# Altium schematic sheet MCU-Board.SchDoc: MCU Board
size A3; SheetNumber: 1; SheetTotal: 1
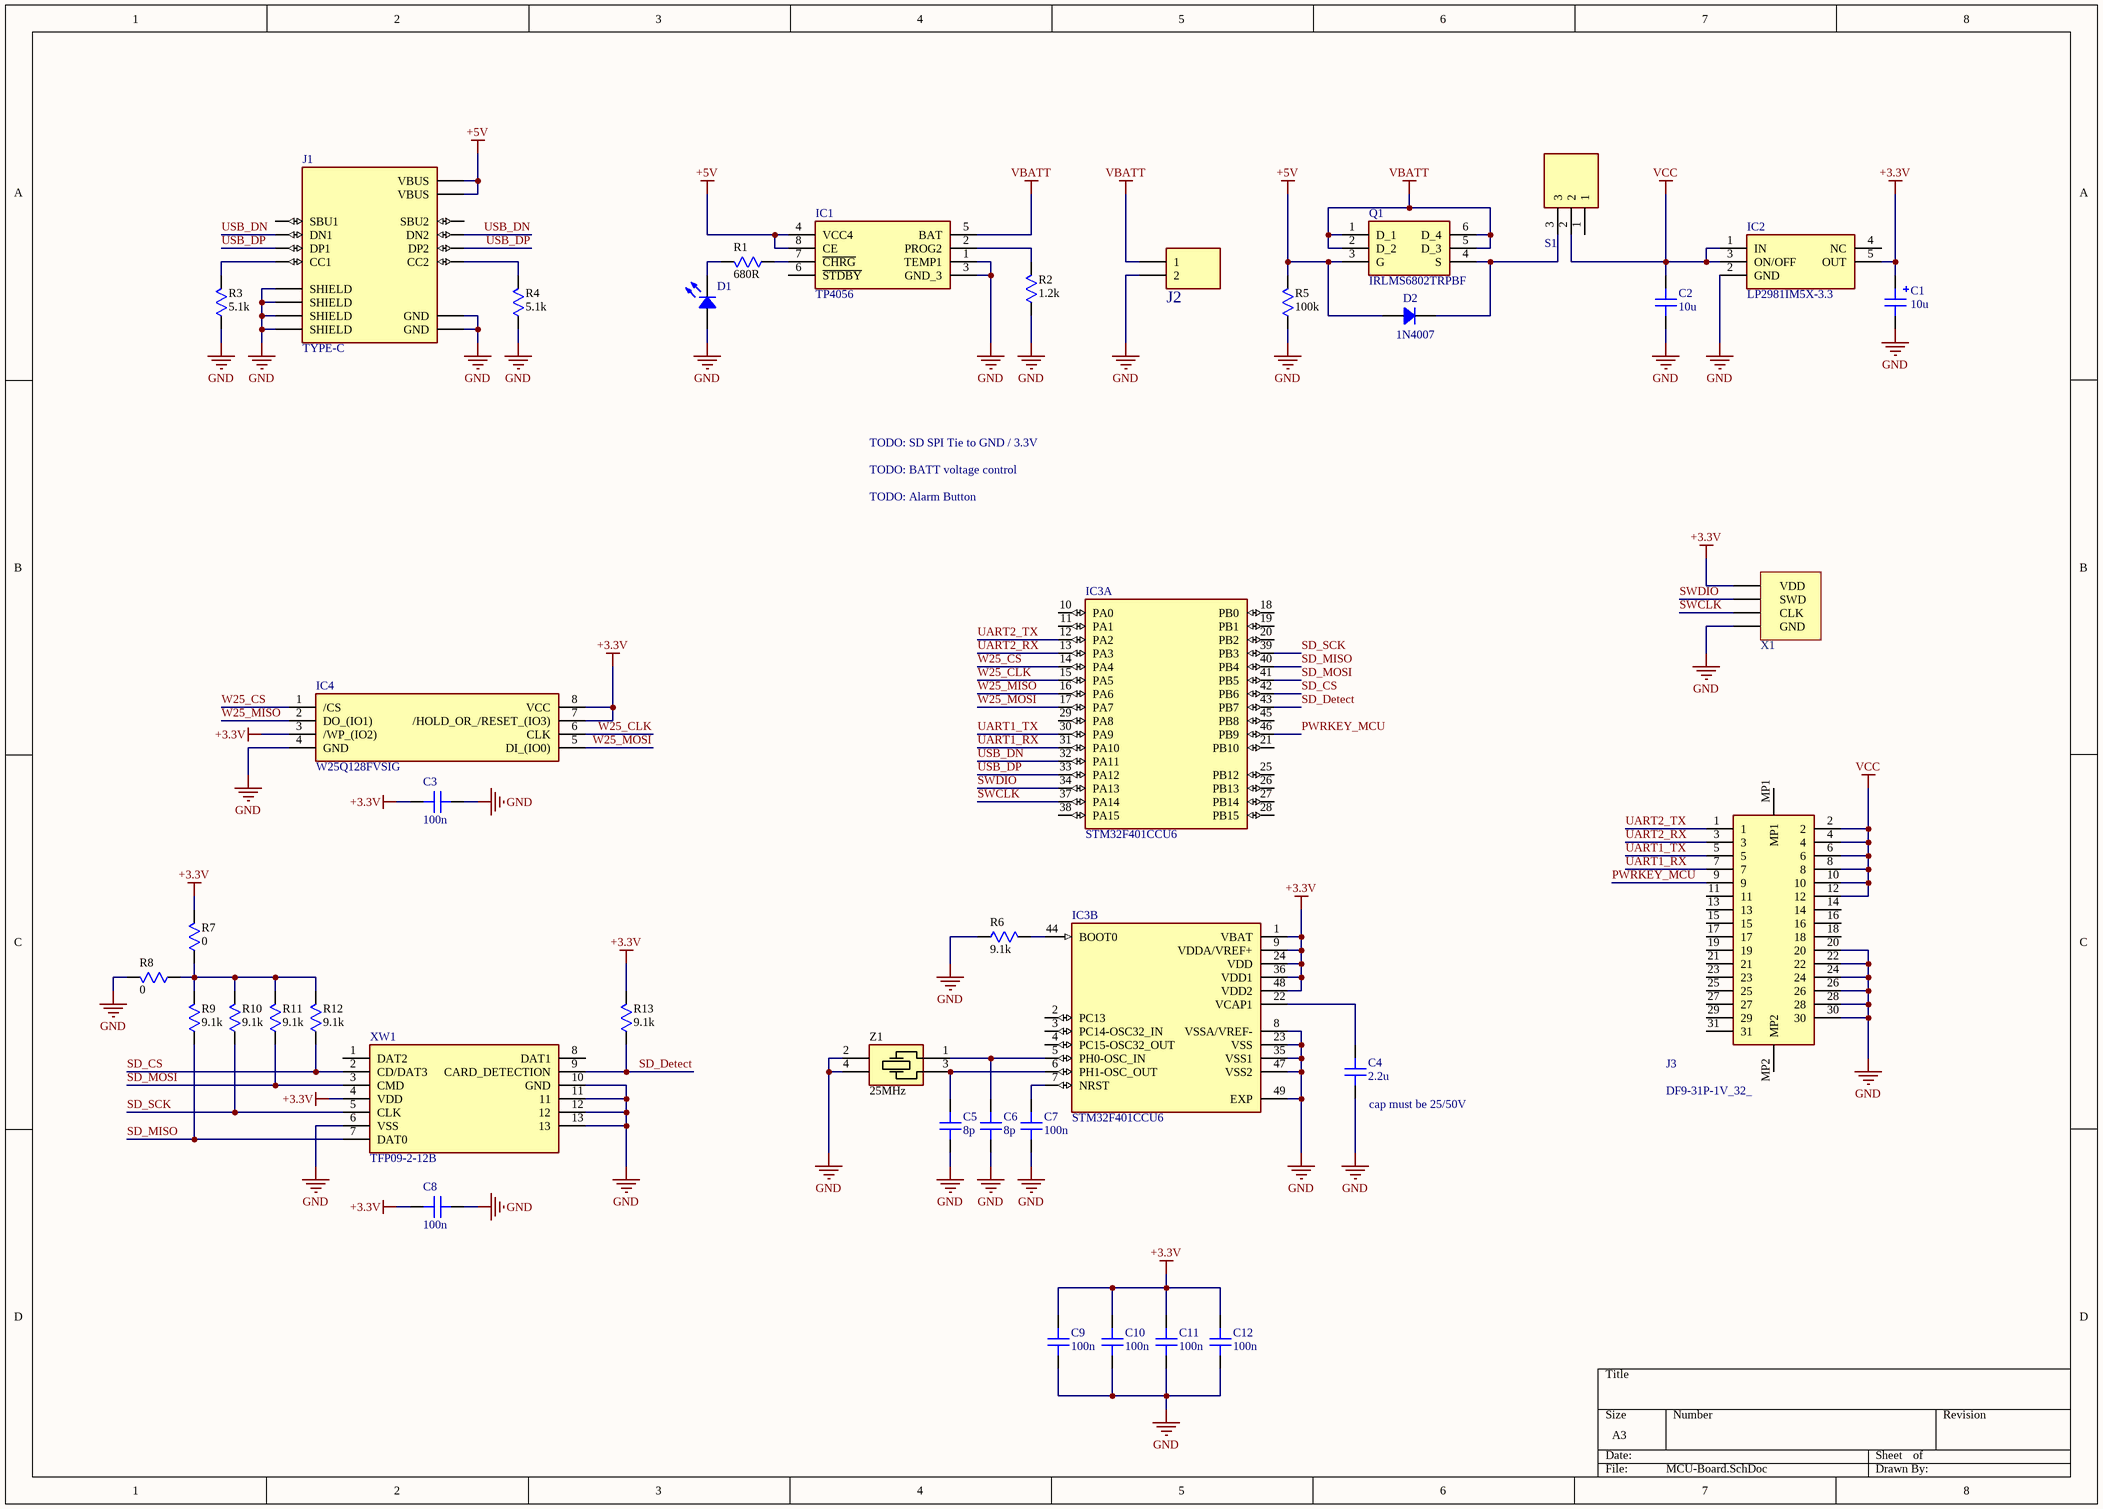
[diagram p0: MCU-Board.SchDoc]

## Parts
C1  10u  [CAP: TANTAL-A]
C2  10u  [CAP: 0805]
C3  100n  [CAP: 0603]
C4  2.2u  [CAP: 0805]
C5  8p  [CAP: 0603]
C6  8p  [CAP: 0603]
C7  100n  [CAP: 0603]
C8  100n  [CAP: 0603]
C9  100n  [CAP: 0603]
C10  100n  [CAP: 0603]
C11  100n  [CAP: 0603]
C12  100n  [CAP: 0603]
D1  (no value)  [LED 0603_1608]
D2  1N4007  [DIODE: SMA]
IC1  TP4056  [SOIC127P600X175-9N]
IC2  LP2981IM5X-3.3  [SOT95P280X145-5N]
IC3  STM32F401CCU6  [QFN50P700X700X60-49N-D]  (parts A,B of 2)
IC4  W25Q128FVSIG  [SOIC127P790X216-8N]
J1  TYPE-C  [HRO_TYPE-C-31-M-12]
J2  NX1500-02SMR  [NX1500-02SMR]  (value not drawn)
J3  DF9-31P-1V_32_  [DF931P1V32]
Q1  IRLMS6802TRPBF  [SOT95P280X130-6N]
R1  value 680R  [RES: 0603]
R2  value 1.2k  [RES: 0805]
R3  value 5.1k  [RES: 0603]
R4  value 5.1k  [RES: 0603]
R5  value 100k  [RES: 0603]
R6  value 9.1k  [RES: 0603]
R7  value 0  [RES: 0603]
R8  value 0  [RES: 0603]
R9  value 9.1k  [RES: 0603]
R10  value 9.1k  [RES: 0603]
R11  value 9.1k  [RES: 0603]
R12  value 9.1k  [RES: 0603]
R13  value 9.1k  [RES: 0603]
S1  OS102011MA1QN1  [OS102011MA1QN1]  (value not drawn)
X1  (no value)  [CON: PLS-4R]
XW1  TFP09-2-12B  [TFP09212B]
Z1  Frequency: 25MHz  [OSC: 3225]

## Nets
+3.3V: C1.1 C3.2 C8.2 C9.2 C10.2 C11.2 C12.2 IC2.5(OUT) IC3.1(VBAT) IC3.9(VDDA/VREF+) IC3.24(VDD) IC3.36(VDD1) IC3.48(VDD2) IC4.3(/WP_(IO2)) IC4.7(/HOLD_OR_/RESET_(IO3)) IC4.8(VCC) R7.2 R13.2 X1.1(VDD) XW1.4(VDD)
+5V: D2.1 IC1.4(VCC4) IC1.8(CE) J1.A4B9(VBUS) J1.B4A9(VBUS) Q1.3(G) R5.2
GND: C1.2 C2.1 C3.1 C4.1 C5.1 C6.2 C7.1 C8.1 C9.1 C10.1 C11.1 C12.1 D1.1 IC1.1(TEMP1) IC1.3(GND_3) IC2.2(GND) IC3.8(VSSA/VREF-) IC3.23(VSS) IC3.35(VSS1) IC3.47(VSS2) IC3.49(EXP) IC4.4(GND) J1.A1B12(GND) J1.B1A12(GND) J1.S1(SHIELD) J1.S2(SHIELD) J1.S3(SHIELD) J1.S4(SHIELD) J2.2 J3.20 J3.22 J3.24 J3.26 J3.28 J3.30 R2.1 R3.1 R4.1 R5.1 R6.1 R8.2 X1.4(GND) XW1.6(VSS) XW1.10(GND) XW1.11 XW1.12 XW1.13 Z1.2 Z1.4
VBATT: IC1.5(BAT) J2.1 Q1.1(D_1) Q1.2(D_2) Q1.5(D_3) Q1.6(D_4)
VCC: C2.2 IC2.1(IN) IC2.3(ON/OFF) J3.2 J3.4 J3.6 J3.8 J3.10 J3.12 S1.2
PWRKEY_MCU: IC3.46(PB9) J3.9
SD_CS: IC3.42(PB6) R12.1 XW1.2(CD/DAT3)
SD_Detect: IC3.43(PB7) R13.1 XW1.9(CARD_DETECTION)
SD_MISO: IC3.40(PB4) R9.1 XW1.7(DAT0)
SD_MOSI: IC3.41(PB5) R11.1 XW1.3(CMD)
SD_SCK: IC3.39(PB3) R10.1 XW1.5(CLK)
SWCLK: IC3.37(PA14) X1.3(CLK)
SWDIO: IC3.34(PA13) X1.2(SWD)
UART1_RX: IC3.31(PA10) J3.7
UART1_TX: IC3.30(PA9) J3.5
UART2_RX: IC3.13(PA3) J3.3
UART2_TX: IC3.12(PA2) J3.1
USB_DN: IC3.32(PA11) J1.A7(DN1) J1.B7(DN2)
USB_DP: IC3.33(PA12) J1.A6(DP1) J1.B6(DP2)
W25_CLK: IC3.15(PA5) IC4.6(CLK)
W25_CS: IC3.14(PA4) IC4.1(/CS)
W25_MISO: IC3.16(PA6) IC4.2(DO_(IO1))
W25_MOSI: IC3.17(PA7) IC4.5(DI_(IO0))
NetC4_2: C4.2 IC3.22(VCAP1)
NetC5_2: C5.2 IC3.6(PH1-OSC_OUT) Z1.3
NetC6_1: C6.1 IC3.5(PH0-OSC_IN) Z1.1
NetC7_2: C7.2 IC3.7(NRST)
NetD1_2: D1.2 R1.2
NetD2_2: D2.2 Q1.4(S) S1.3
NetIC1_2: IC1.2(PROG2) R2.2
NetIC1_7: IC1.7(~{CHRG}) R1.1
NetIC3_44: IC3.44(BOOT0) R6.2
NetJ1_A5: J1.A5(CC1) R3.2
NetJ1_B5: J1.B5(CC2) R4.2
NetR7_1: R7.1 R8.1 R9.2 R10.2 R11.2 R12.2

Not connected (* = marked no-connect by the designer): IC1 6(~{STDBY}); IC2 4(NC); IC3 2(PC13) 3(PC14-OSC32_IN) 4(PC15-OSC32_OUT) 10(PA0) 11(PA1) 18(PB0) 19(PB1) 20(PB2) 21(PB10) 25(PB12) 26(PB13) 27(PB14) 28(PB15) 29(PA8) 38(PA15) 45(PB8); J1 A8(SBU1) B8(SBU2); J3 11 13 14 15 16 17 18 19 21 23 25 27 29 31 MP1 MP2; S1 1; XW1 1(DAT2) 8(DAT1)

## Notes on the sheet
- TODO: SD SPI Tie to GND / 3.3V
- TODO: BATT voltage control
- TODO: Alarm Button
- (near C4) cap must be 25/50V

## Library data of the parts
C1 = Capacitor_polar: SMD Capacitor Polar
C2-C12 = Capacitor: SMD Capacitor
D1 = LED: Chip LED
D2 = Diode: Rectifier Diode
IC1 = TP4056: Connector; Manufacturer_Name: NanJing Top Power; Datasheet Link: https://dlnmh9ip6v2uc.cloudfront.net/datasheets/Prototyping/TP4056.pdf; Height: 1.75mm; Manufacturer_Part_Number: TP4056
IC2 = LP2981IM5X-3.3: Integrated Circuit; Manufacturer_Name: Texas Instruments; Manufacturer_Part_Number: LP2981IM5X-5.0; Datasheet Link: https://www.ti.com/lit/ds/symlink/lp2981-n.pdf?ts=1629199672850&ref_url=https%253A%252F%252Fwww.ti.com%252Fstore%252Fti%252Fen%252Fp%252Fproduct%252F%253Fp%253DLP2981IM5X-5.0%252FNOPB; Height: 1.45mm; Mouser Part Number: 926-LP2981IM5X-50; Mouser Price/Stock: https://www.mouser.com/Search/Refine.aspx?Keyword=926-LP2981IM5X-50
IC3 = STM32F401CCU6: Integrated Circuit; Manufacturer_Name: STMicroelectronics; Datasheet Link: http://www.st.com/web/en/resource/technical/document/datasheet/DM00086815.pdf; Height: 0.6mm; Manufacturer_Part_Number: STM32F401CCU6; Mouser Part Number: 511-STM32F401CCU6; Mouser Price/Stock: https://www.mouser.co.uk/ProductDetail/STMicroelectronics/STM32F401CCU6?qs=DqCdCwOw4%2F5VrOZQxO795A%3D%3D; Arrow Part Number: STM32F401CCU6; Arrow Price/Stock: https://www.arrow.com/en/products/stm32f401ccu6/stmicroelectronics?region=nac
IC4 = W25Q128FVSIG: Integrated Circuit; Manufacturer_Name: Winbond; Datasheet Link: https://www.winbond.com/resource-files/w25q128fv rev.m 05132016 kms.pdf; Height: 2.16mm; Manufacturer_Part_Number: W25Q128FVSIG; Mouser Part Number: N/A; Mouser Price/Stock: https://www.mouser.co.uk/ProductDetail/Winbond/W25Q128FVSIG?qs=rkhjVJ6%2F3EIwu4pV702YLQ%3D%3D; Arrow Part Number: W25Q128FVSIG; Arrow Price/Stock: https://www.arrow.com/en/products/w25q128fvsig/winbond-electronics
J1 = TYPE-C-31-M-12: USB Connectors 24 Receptacle 1 8.94*7.3mm RoHS; Package: None; Availability: Unavailable; Value: *; MP: TYPE-C-31-M-12; Price: None
J3 = DF9-31P-1V_32_: Connector; Manufacturer_Name: Hirose; Manufacturer_Part_Number: DF9-31P-1V(32); Datasheet Link: https://datasheet.datasheetarchive.com/originals/distributors/SFDatasheet-7/sf-000141250.pdf; Height: 3.5mm; Mouser Part Number: 798-DF9-31P-1V32; Mouser Price/Stock: https://www.mouser.co.uk/ProductDetail/Hirose-Connector/DF9-31P-1V32?qs=zOgoZG1CgI9P5hPtT7oVcw%3D%3D; Arrow Part Number: DF9-31P-1V(32); Arrow Price/Stock: https://www.arrow.com/en/products/df9-31p-1v-32/hirose-electric; System: Connector
Q1 = IRLMS6802TRPBF: MOSFET (P-Channel); Manufacturer_Name: Infineon; Datasheet Link: https://www.infineon.com/dgdl/irlms6802pbf.pdf?fileId=5546d462533600a401535669349a2654; Height: 1.3mm; Manufacturer_Part_Number: IRLMS6802TRPBF; Mouser Part Number: 942-IRLMS6802TRPBF; Mouser Price/Stock: https://www.mouser.co.uk/ProductDetail/Infineon-IR/IRLMS6802TRPBF?qs=9%252BKlkBgLFf3%252B6QUsVmNV1g%3D%3D; Arrow Part Number: IRLMS6802TRPBF; Arrow Price/Stock: https://www.arrow.com/en/products/irlms6802trpbf/infineon-technologies-ag
R1-R13 = Resistor: Manufacturer: Yageo; PartNumber: RC0201JR-07100RL; TypeResistor: Resistor film; Power: 0.05W; Package: 0201; HelpURL: https://www.digikey.com/product-detail/en/yageo/RC0201JR-07100RL/311-100NCT-ND/1949006; ValueManufacturerPartNumber: =TypeResistor+', '+Value+', '+Tolerance+', '+Package+', '+Power+', '+Temperature; Temperature: -55...+125°C
S1 = OS102011MA1QN1: Switch; Manufacturer_Name: C & K COMPONENTS; Datasheet Link: http://www.ckswitches.com/media/1428/os.pdf; Manufacturer_Part_Number: OS102011MA1QN1; Mouser Part Number: 611-OS102011MA1QN1; Mouser Price/Stock: https://www.mouser.co.uk/ProductDetail/CK/OS102011MA1QN1?qs=WtljUlYws5R6MUgHcLkz4w%3D%3D; Arrow Part Number: OS102011MA1QN1; Arrow Price/Stock: https://www.arrow.com/en/products/os102011ma1qn1/ck?region=europe
X1 = Connector SWD: SWD Interface; pin to pad: 1>2 2>1
XW1 = TFP09-2-12B: Connector; Manufacturer_Name: 100y; Datasheet Link: http://images.100y.com.tw/pdf_file/10-TFP09-2-12B.pdf; Height: 2.45mm; Manufacturer_Part_Number: TFP09-2-12B
Z1 = Crystal: Manufacturer: Murata Electronics; PartNumber: XRCGB25M000F0L00R0; ValueManufacturerPartNumber: Crystal, 25MHz, 6pF, ±50ppm, case 2016, -30...+85°C; LoadCapacitance: 6pF; Tolerance: ±50ppm; Package: case 2016; HelpURL: https://www.digikey.com/product-detail/en/murata-electronics-north-america/XRCGB25M000F0L00R0/490-5577-1-ND/2368391; Temperature: -30...+85°C; TypeOscilator: Crystal